# Altium project VCTB.PrjPcb
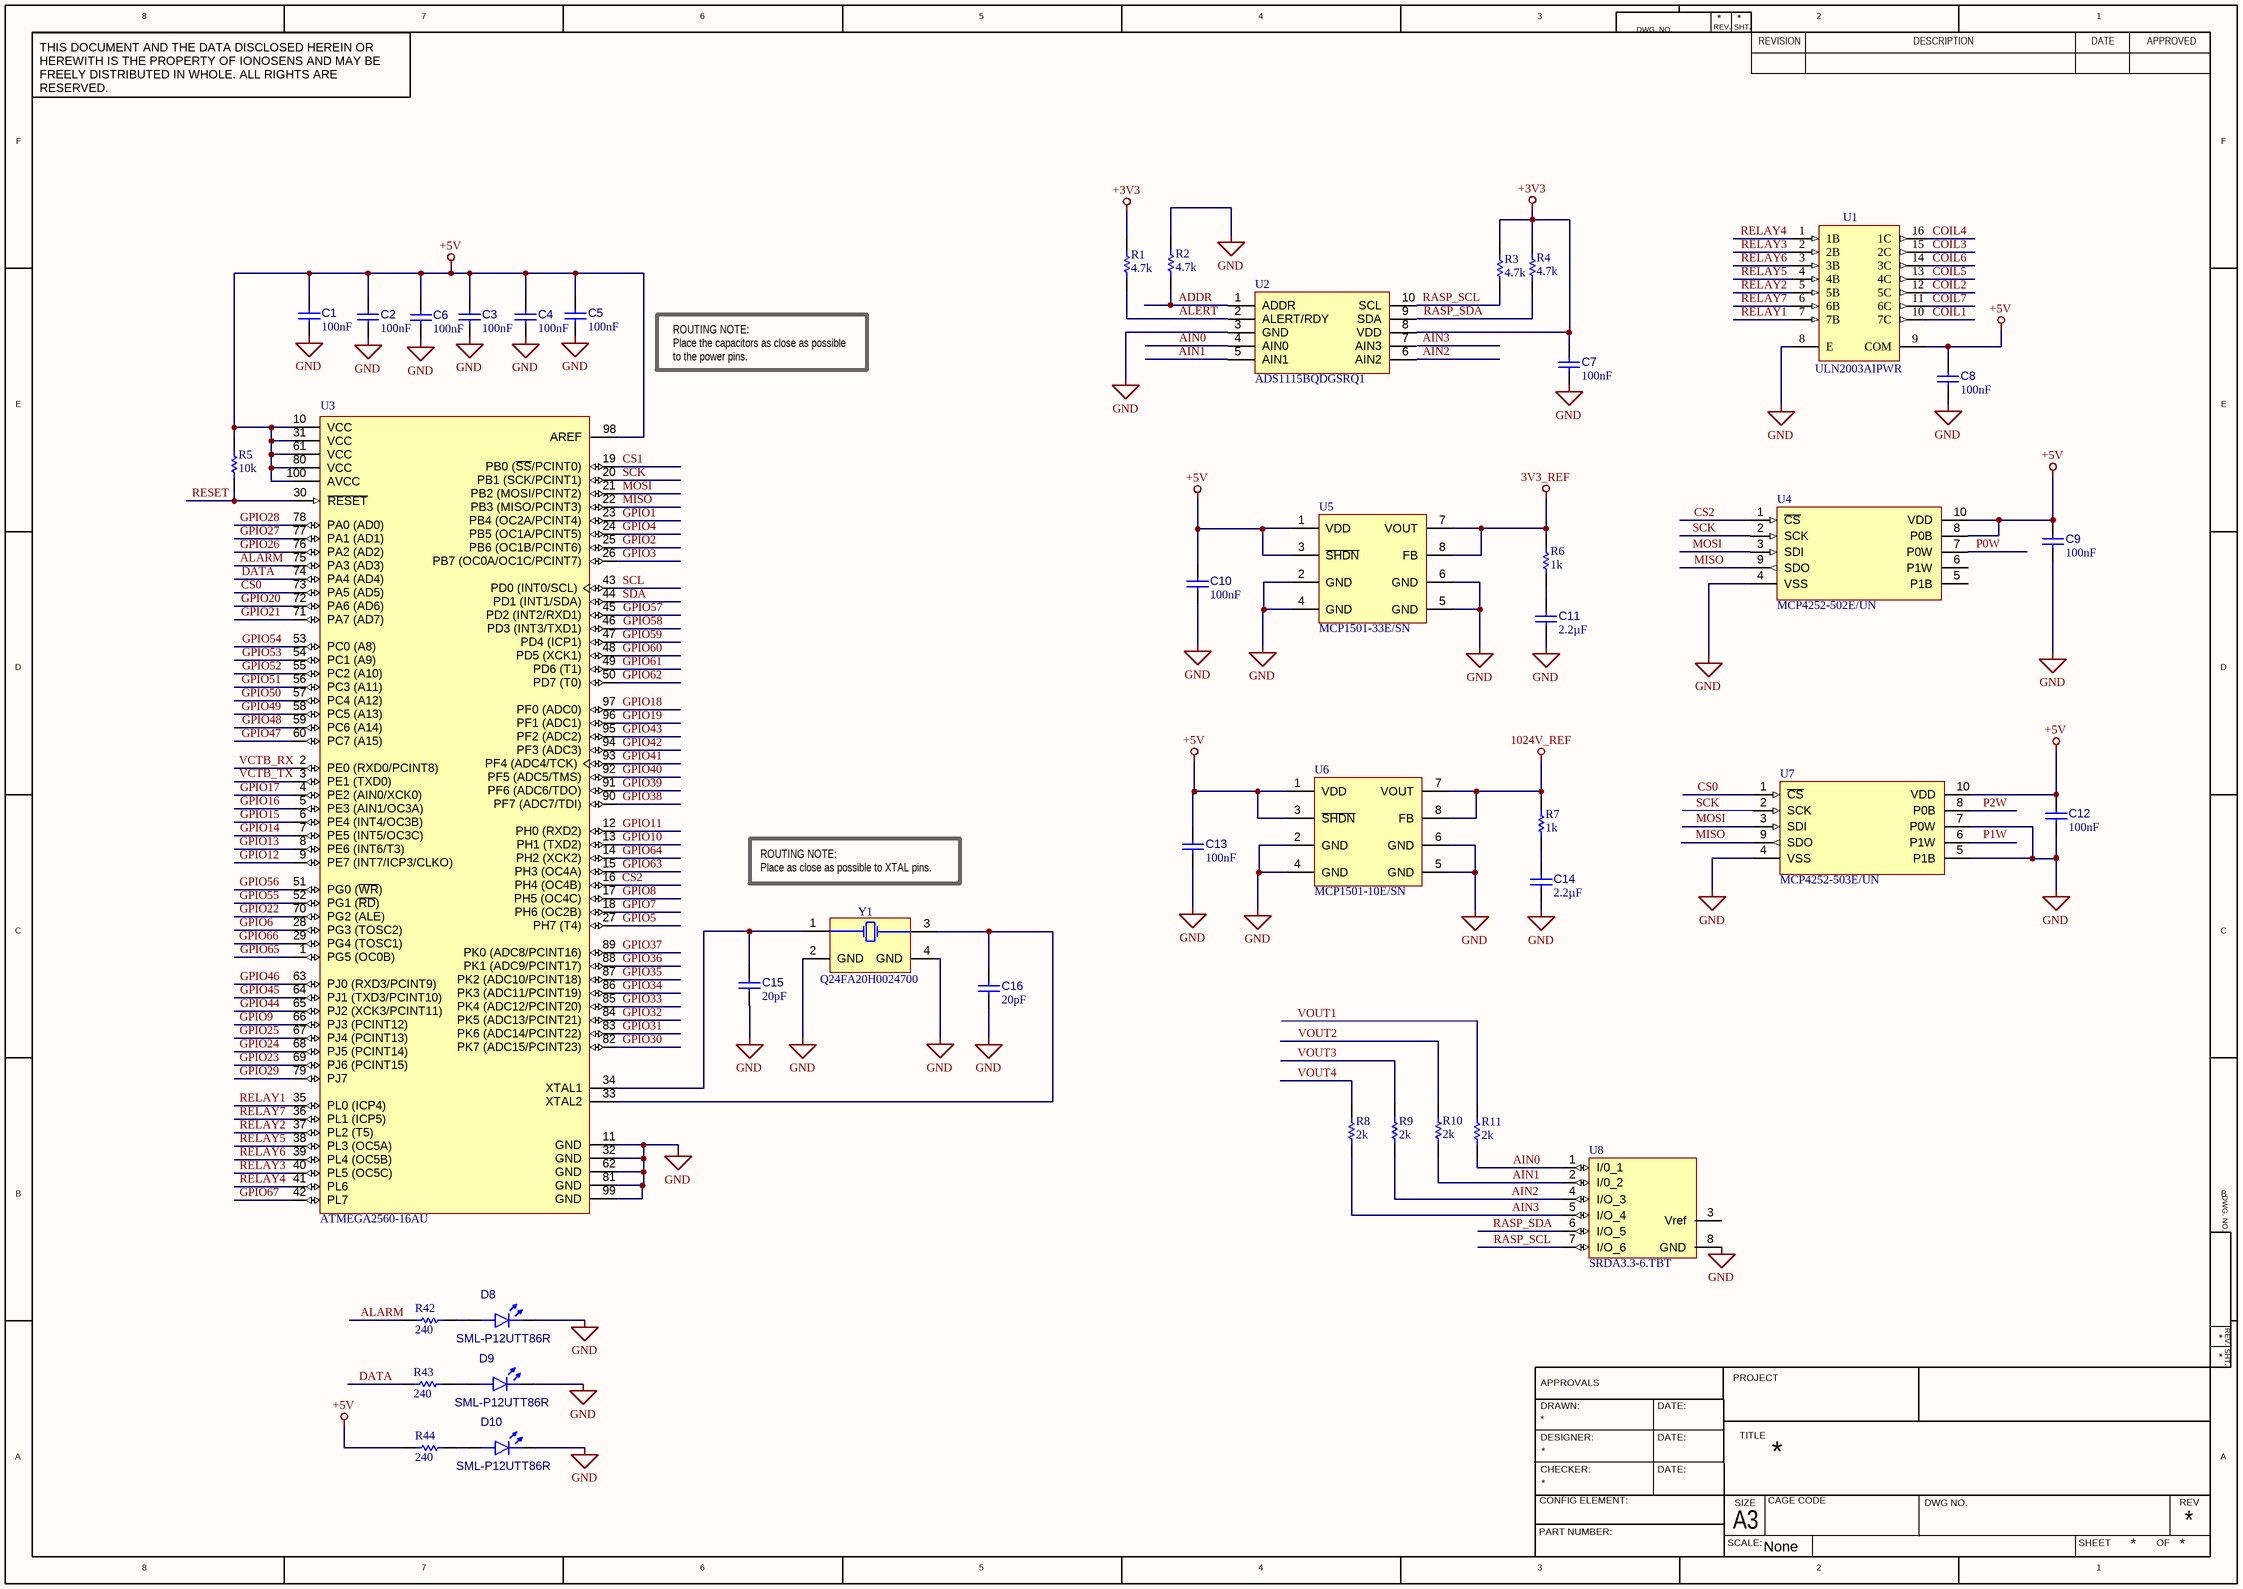
[diagram p0: Sheet1.SchDoc]
3 sheets, 104 parts. Net scope: global (net labels, ports and power ports of the same name join across sheets).
Board file: PCB1.PcbDoc
Sheets:
  Sheet1.SchDoc
  Sheet2.SchDoc
  Sheet3.SchDoc

## Sheet Sheet1.SchDoc
size 420 x 297 mm; Scale: None

### Parts
C1  value 100nF  [CAPC1005X06M]  (hidden comment: CC0402JRX7R7BB104)
C2  value 100nF  [CAPC1005X06M]  (hidden comment: CC0402JRX7R7BB104)
C3  value 100nF  [CAPC1005X06M]  (hidden comment: CC0402JRX7R7BB104)
C4  value 100nF  [CAPC1005X06M]  (hidden comment: CC0402JRX7R7BB104)
C5  value 100nF  [CAPC1005X06M]  (hidden comment: CC0402JRX7R7BB104)
C6  value 100nF  [CAPC1005X06M]  (hidden comment: CC0402JRX7R7BB104)
C7  value 100nF  [CAPC1005X06M]  (hidden comment: CC0402JRX7R7BB104)
C8  value 100nF  [CAPC1005X06M]  (hidden comment: CC0402JRX7R7BB104)
C9  value 100nF  [CAPC1005X06M]  (hidden comment: CC0402JRX7R7BB104)
C10  value 100nF  [CAPC1005X06M]  (hidden comment: CC0402JRX7R7BB104)
C11  value 2.2µF  [CAPC2012X14M]  (hidden comment: AC0805KKX7R8BB225)
C12  value 100nF  [CAPC1005X06M]  (hidden comment: CC0402JRX7R7BB104)
C13  value 100nF  [CAPC1005X06M]  (hidden comment: CC0402JRX7R7BB104)
C14  value 2.2µF  [CAPC2012X14M]  (hidden comment: AC0805KKX7R8BB225)
C15  value 20pF  [CAPC1005X06M]  (hidden comment: CC0402JRNPO9BN200)
C16  value 20pF  [CAPC1005X06M]  (hidden comment: CC0402JRNPO9BN200)
D8  SML-P12UTT86R  [DIOC1005X02R]
D9  SML-P12UTT86R  [DIOC1005X02R]
D10  SML-P12UTT86R  [DIOC1005X02R]
R1  value 4.7k  [RESC1005X04M]  (hidden comment: AC0402FR-074K7L)
R2  value 4.7k  [RESC1005X04M]  (hidden comment: AC0402FR-074K7L)
R3  value 4.7k  [RESC1005X04M]  (hidden comment: AC0402FR-074K7L)
R4  value 4.7k  [RESC1005X04M]  (hidden comment: AC0402FR-074K7L)
R5  value 10k  [RESC1005X04M]  (hidden comment: AC0402FR-0710KL)
R6  value 1k  [RESC1005X04M]  (hidden comment: AC0402FR-071KL)
R7  value 1k  [RESC1005X04M]  (hidden comment: AC0402FR-071KL)
R8  value 2k  [RESC1005X04M]  (hidden comment: AC0402FR-072KL)
R9  value 2k  [RESC1005X04M]  (hidden comment: AC0402FR-072KL)
R10  value 2k  [RESC1005X04M]  (hidden comment: AC0402FR-072KL)
R11  value 2k  [RESC1005X04M]  (hidden comment: AC0402FR-072KL)
R42  value 240  [RESC1005X04M]  (hidden comment: AC0402FR-07240RL)
R43  value 240  [RESC1005X04M]  (hidden comment: AC0402FR-07240RL)
R44  value 240  [RESC1005X04M]  (hidden comment: AC0402FR-07240RL)
U1  ULN2003AIPWR  [TSOP65P640X120-16M]
U2  ADS1115BQDGSRQ1  [TSSOP50P490X110-10M]
U3  ATMEGA2560-16AU  [ATML-100A_M]
U4  MCP4252-502E/UN  [TSSOP50P490X110-10N]
U5  MCP1501-33E/SN  [SOIC127P600X175-8M]
U6  MCP1501-10E/SN  [SOIC127P600X175-8M]
U7  MCP4252-503E/UN  [TSSOP50P490X110-10N]
U8  SRDA3.3-6.TBT  [SOIC127P600X175-8M]
Y1  Q24FA20H0024700  [FA-20H]

### Nets
3V3_REF: R6.2 U5.7(VOUT) U5.8(FB)
1024V_REF: R7.2 U6.7(VOUT) U6.8(FB)
+3V3: C7.2 R1.2 R3.2 R4.2 U2.8(VDD)
+5V: C1.2 C2.2 C3.2 C4.2 C5.2 C6.2 C8.2 C9.2 C10.2 C12.2 C13.2 R5.2 R44.1 U1.9(COM) U3.10(VCC) U3.31(VCC) U3.61(VCC) U3.80(VCC) U3.98(AREF) U3.100(AVCC) U4.8(P0B) U4.10(VDD) U5.1(VDD) U5.3(~{SHDN}) U6.1(VDD) U6.3(~{SHDN}) U7.10(VDD)
GND: C1.1 C2.1 C3.1 C4.1 C5.1 C6.1 C7.1 C8.1 C9.1 C10.1 C11.1 C12.1 C13.1 C14.1 C15.1 C16.1 D8.1(K) D9.1(K) D10.1(K) R2.2 U1.8(E) U2.3(GND) U3.11(GND) U3.32(GND) U3.62(GND) U3.81(GND) U3.99(GND) U4.4(VSS) U5.2(GND) U5.4(GND) U5.5(GND) U5.6(GND) U6.2(GND) U6.4(GND) U6.5(GND) U6.6(GND) U7.4(VSS) U7.5(P1B) U7.7(P0W) U8.8(GND) Y1.2(GND) Y1.4(GND)
ADDR: R2.1 U2.1(ADDR)
AIN0: R11.2 U2.4(AIN0) U8.1(I/0_1)
AIN1: R10.1 U2.5(AIN1) U8.2(I/0_2)
AIN2: R9.1 U2.6(AIN2) U8.4(I/O_3)
AIN3: R8.1 U2.7(AIN3) U8.5(I/O_4)
ALARM: R42.1 U3.75(PA3_(AD3))
ALERT: R1.1 U2.2(ALERT/RDY)
COIL1: U1.10(7C)
COIL2: U1.12(5C)
COIL3: U1.15(2C)
COIL4: U1.16(1C)
COIL5: U1.13(4C)
COIL6: U1.14(3C)
COIL7: U1.11(6C)
CS0: U3.73(PA5_(AD5)) U7.1(~{CS})
CS1: U3.19(PB0_(~{SS}/PCINT0))
CS2: U3.16(PH4_(OC4B)) U4.1(~{CS})
DATA: R43.1 U3.74(PA4_(AD4))
GPIO1: U3.23(PB4_(OC2A/PCINT4))
GPIO2: U3.25(PB6_(OC1B/PCINT6))
GPIO3: U3.26(PB7_(OC0A/OC1C/PCINT7))
GPIO4: U3.24(PB5_(OC1A/PCINT5))
GPIO5: U3.27(PH7_(T4))
GPIO6: U3.28(PG3_(TOSC2))
GPIO7: U3.18(PH6_(OC2B))
GPIO8: U3.17(PH5_(OC4C))
GPIO9: U3.66(PJ3_(PCINT12))
GPIO10: U3.13(PH1_(TXD2))
GPIO11: U3.12(PH0_(RXD2))
GPIO12: U3.9(PE7_(INT7/ICP3/CLKO))
GPIO13: U3.8(PE6_(INT6/T3))
GPIO14: U3.7(PE5_(INT5/OC3C))
GPIO15: U3.6(PE4_(INT4/OC3B))
GPIO16: U3.5(PE3_(AIN1/OC3A))
GPIO17: U3.4(PE2_(AIN0/XCK0))
GPIO18: U3.97(PF0_(ADC0))
GPIO19: U3.96(PF1_(ADC1))
GPIO20: U3.72(PA6_(AD6))
GPIO21: U3.71(PA7_(AD7))
GPIO22: U3.70(PG2_(ALE))
GPIO23: U3.69(PJ6_(PCINT15))
GPIO24: U3.68(PJ5_(PCINT14))
GPIO25: U3.67(PJ4_(PCINT13))
GPIO26: U3.76(PA2_(AD2))
GPIO27: U3.77(PA1_(AD1))
GPIO28: U3.78(PA0_(AD0))
GPIO29: U3.79(PJ7)
GPIO30: U3.82(PK7_(ADC15/PCINT23))
GPIO31: U3.83(PK6_(ADC14/PCINT22))
GPIO32: U3.84(PK5_(ADC13/PCINT21))
GPIO33: U3.85(PK4_(ADC12/PCINT20))
GPIO34: U3.86(PK3_(ADC11/PCINT19))
GPIO35: U3.87(PK2_(ADC10/PCINT18))
GPIO36: U3.88(PK1_(ADC9/PCINT17))
GPIO37: U3.89(PK0_(ADC8/PCINT16))
GPIO38: U3.90(PF7_(ADC7/TDI))
GPIO39: U3.91(PF6_(ADC6/TDO))
GPIO40: U3.92(PF5_(ADC5/TMS))
GPIO41: U3.93(PF4_(ADC4/TCK))
GPIO42: U3.94(PF3_(ADC3))
GPIO43: U3.95(PF2_(ADC2))
GPIO44: U3.65(PJ2_(XCK3/PCINT11))
GPIO45: U3.64(PJ1_(TXD3/PCINT10))
GPIO46: U3.63(PJ0_(RXD3/PCINT9))
GPIO47: U3.60(PC7_(A15))
GPIO48: U3.59(PC6_(A14))
GPIO49: U3.58(PC5_(A13))
GPIO50: U3.57(PC4_(A12))
GPIO51: U3.56(PC3_(A11))
GPIO52: U3.55(PC2_(A10))
GPIO53: U3.54(PC1_(A9))
GPIO54: U3.53(PC0_(A8))
GPIO55: U3.52(PG1_(~{RD}))
GPIO56: U3.51(PG0_(~{WR}))
GPIO57: U3.45(PD2_(INT2/RXD1))
GPIO58: U3.46(PD3_(INT3/TXD1))
GPIO59: U3.47(PD4_(ICP1))
GPIO60: U3.48(PD5_(XCK1))
GPIO61: U3.49(PD6_(T1))
GPIO62: U3.50(PD7_(T0))
GPIO63: U3.15(PH3_(OC4A))
GPIO64: U3.14(PH2_(XCK2))
GPIO65: U3.1(PG5_(OC0B))
GPIO66: U3.29(PG4_(TOSC1))
GPIO67: U3.42(PL7)
MISO: U3.22(PB3_(MISO/PCINT3)) U4.9(SDO) U7.9(SDO)
MOSI: U3.21(PB2_(MOSI/PCINT2)) U4.3(SDI) U7.3(SDI)
P0W: U4.7(P0W)
P1W: U7.6(P1W)
P2W: U7.8(P0B)
RASP_SCL: R3.1 U2.10(SCL) U8.7(I/O_6)
RASP_SDA: R4.1 U2.9(SDA) U8.6(I/O_5)
RELAY1: U1.7(7B) U3.35(PL0_(ICP4))
RELAY2: U1.5(5B) U3.37(PL2_(T5))
RELAY3: U1.2(2B) U3.40(PL5_(OC5C))
RELAY4: U1.1(1B) U3.41(PL6)
RELAY5: U1.4(4B) U3.38(PL3_(OC5A))
RELAY6: U1.3(3B) U3.39(PL4_(OC5B))
RELAY7: U1.6(6B) U3.36(PL1_(ICP5))
RESET: R5.1 U3.30(~{RESET})
SCK: U3.20(PB1_(SCK/PCINT1)) U4.2(SCK) U7.2(SCK)
SCL: U3.43(PD0_(INT0/SCL))
SDA: U3.44(PD1_(INT1/SDA))
VCTB_RX: U3.2(PE0_(RXD0/PCINT8))
VCTB_TX: U3.3(PE1_(TXD0))
VOUT1: R11.1
VOUT2: R10.2
VOUT3: R9.2
VOUT4: R8.2
NetC11_2: C11.2 R6.1
NetC14_2: C14.2 R7.1
NetC15_2: C15.2 U3.34(XTAL1) Y1.1(X1)
NetC16_2: C16.2 U3.33(XTAL2) Y1.3(X2)
NetD8_2: D8.2(A) R42.2
NetD9_2: D9.2(A) R43.2
NetD10_2: D10.2(A) R44.2

Not connected (* = marked no-connect by the designer): U4 5(P1B) 6(P1W); U8 3(Vref)

### Notes on the sheet
- ROUTING NOTE:
  Place the capacitors as close as possible to the power pins.
- (near Y1) ROUTING NOTE:
  Place as close as possible to XTAL pins.
- 8
- 7
- 6
- 5
- 4
- 3
- DWG. NO.
- REV.
- SHT.
- REVISION
- 2
- DESCRIPTION
- DATE
- 1
- APPROVED
- THIS DOCUMENT AND THE DATA DISCLOSED HEREIN OR HEREWITH IS THE PROPERTY OF IONOSENS AND MAY BE FREELY DISTRIBUTED IN WHOLE. ALL RIGHTS ARE RESERVED.
- F
- E
- D
- C
- B
- DRAWN:
- APPROVALS
- DATE:
- PROJECT
- A
- CHECKER:
- DESIGNER:
- TITLE
- PART NUMBER:
- CONFIG ELEMENT:
- SCALE:
- A3
- SIZE
- CAGE CODE
- DWG NO.
- SHEET
- OF
- REV

### Library data of the parts
C1-C10 C12 C13 = C01-0402-01-00001-1: Cap Ceramic 100nF 50V X7R 5% SMD 0402 125°C; Manufacturer: YAGEO; Voltage Rating: 16V; Case/Package: 0402; Capacitor Type: Ceramic; Min Operating Temperature: -55°C; Width: 508µm; Length: 1mm; Tolerance: 5%; Dielectric: X7R; RoHS Compliant: Yes; Pins: 2; Composition: Ceramic; Depth: 500µm; Voltage Rating (DC): 16V; Mount: Surface Mount; Mounting Technology: Surface Mount; Termination: SMD/SMT; Manufacturer P/N: CC0402JRX7R7BB104; Thickness: 558.8µm; Max Operating Temperature: 125°C
C11 C14 = C01-0402-01-00007-1: Cap Ceramic 2.2uF 25V X7R +-10% SMD 0805 125°C; Manufacturer: YAGEO; Tolerance: 10%; Dielectric: XR7; Max Operating Temperature: 125°C; Composition: Ceramic; Min Operating Temperature: -55°C; Thickness: 711.2µm; Depth: 1.25mm; RoHS Compliant: Yes; Width: 1.2466mm; Mounting Technology: Surface Mount; Case/Package: 0805; Termination: SMD/SMT; Voltage Rating: 25V; Pins: 2; Mount: Surface Mount; Manufacturer P/N: AC0805KKX7R8BB225; Capacitor Type: Ceramic; Length: 2mm; Voltage Rating (DC): 25V
C15 C16 = C01-0402-01-00008-1: Cap Ceramic 20pF 50V C0G 5% SMD 0402 125°C; Manufacturer: YAGEO; Dielectric: COG; Case/Package: 0402; Tolerance: 5%; Thickness: 558.8µm; Termination: SMD/SMT; Manufacturer P/N: CC0402JRNPO9BN200; Voltage Rating: 50V; Length: 990.6µm; Depth: 500µm; Width: 508µm; Min Operating Temperature: -55°C; Mount: Surface Mount; Voltage Rating (DC): 50V; Pins: 2; Capacitor Type: Ceramic; RoHS Compliant: Yes; Composition: Ceramic; Mounting Technology: Surface Mount; Max Operating Temperature: 125°C
D8-D10 = D01-0402-01-00001-1: Led red 0402; Manufacturer: ROHM; Number of LEDs: 1; Max Power Dissipation: 52mW; Luminous Intensity: 85 mcd; Dominant Wavelength: 620 nm; Lens Style: Rectangular, Square; Forward Current: 20 mA; Forward Voltage: 2V; Mounting Technology: SMD; Case/Package: 0402; Min Operating Temperature: -40°C; Max Operating Temperature: 85°C; Manufacturer P/N: SML-P12UTT86R; Colour: red; RoHS Compliant: Yes; Pins: 2
R1-R4 = R01-0402-01-00105-2: RES SMD 4.7K OHM 1% 1/16W 0402; Manufacturer: Yageo; Temperature Coefficient: 100 ppm/ºC; Power Rating: 62.5mW; Voltage Rating: 50V; Width: 508µm; Max Operating Temperature: 155°C; Manufacturer P/N: AC0402FR-074K7L; Features: Automotive AEC-Q200, Moisture Resistant; Number of Terminations: 2; Height: 370µm; Min Operating Temperature: -55°C; Case/Package: 0402; Tolerance: 1%; RoHS: Yes; Packaging: Tape & Reel; Composition: Thick Film; Length: 990.6µm
R5 = R01-0402-01-00169-2: RES SMD 10K OHM 1% 1/16W 0402; Manufacturer: Yageo; Temperature Coefficient: 100 ppm/ºC; Power Rating: 62.5mW; Voltage Rating: 50V; Length: 990.6µm; Height: 370µm; Min Operating Temperature: -55°C; Case/Package: 0402; Features: Automotive AEC-Q200, Moisture Resistant; Packaging: Tape & Reel; Width: 508µm; Manufacturer P/N: AC0402FR-0710KL; RoHS: Yes; Max Operating Temperature: 155°C; Tolerance: 1%; Composition: Thick Film; Number of Terminations: 2
R6 R7 = R01-0402-01-00029-2: RES SMD 1K OHM 1% 1/16W 0402; Manufacturer: Yageo; Power Rating: 62.5mW; Voltage Rating: 50V; Temperature Coefficient: 100 ppm/ºC; Length: 990.6µm; Case/Package: 0402; Features: Automotive AEC-Q200, Moisture Resistant; RoHS: Yes; Packaging: Tape & Reel; Min Operating Temperature: -55°C; Composition: Thick Film; Width: 508µm; Number of Terminations: 2; Tolerance: 1%; Height: 370µm; Manufacturer P/N: AC0402FR-071KL; Max Operating Temperature: 155°C
R8-R11 = R01-0402-01-00067-3: RES SMD 2K OHM 1% 1/16W 0402; Manufacturer: Yageo; Voltage Rating: 50V; Power Rating: 62.5mW; Temperature Coefficient: 100 ppm/ºC; Tolerance: 1%; Length: 990.6µm; Width: 508µm; Number of Terminations: 2; Packaging: Tape & Reel; Composition: Thick Film; RoHS: Yes; Height: 370µm; Case/Package: 0402; Manufacturer P/N: AC0402FR-072KL; Features: Automotive AEC-Q200, Moisture Resistant; Min Operating Temperature: -55°C; Max Operating Temperature: 155°C
R42-R44 = R01-0402-01-00437-2: RES SMD 240 OHM 1% 1/16W 0402; Manufacturer: Yageo; Temperature Coefficient: 100 ppm/ºC; Power Rating: 62.5mW; Voltage Rating: 50V; Packaging: Tape & Reel; Manufacturer P/N: AC0402FR-07240RL; Height: 370µm; Case/Package: 0402; Composition: Thick Film; Max Operating Temperature: 155°C; Number of Terminations: 2; RoHS: Yes; Min Operating Temperature: -55°C; Tolerance: 1%; Width: 508µm; Length: 990.6µm; Features: Automotive AEC-Q200, Moisture Resistant
U1 = CMP-0005-0001-00001-1: 50-V, 7-ch darlington transistor array, -40 to 105C 16-TSSOP -40 to 105; Manufacturer: Texas Instruments; Voltage Rating: 50V; Min Operating Temperature: 105°C; RoHS Compliant: yes; Pins: 16; Case/Package: TSSOP; Mounting Technology: SMD; Length: 5mm; Manufacturer P/N: ULN2003AIPWR; Height: 1.2mm; Max Operating Temperature: -40°C; Width: 4.4mm
U2 = CMP-0015-00000-5: 4-Channel Single ADC Delta-Sigma 860sps 16-bit Serial Automotive 10-Pin VSSOP; Manufacturer: Texas Instrument; Channels: 4; Interface: I2C; Min Operating Temperature: -40°C; Mounting Technology: SMD; RoHS Compliant: yes; Pins: 10; Manufacturer P/N: ADS1115BQDGSRQ1; Max Operating Temperature: 125°C; Case/Package: VSSOP10
U3 = U01-0007-01-00000-1: AVR ATmega Microcontroller 8-bit 16MHz 256KB FLASH TQFP100; Manufacturer: Microchip; Oscillator Type: External; Interface: I2C, SPI, UART; Minimum Supply Voltage: 4.5V; Peripherals: Brown-out Detect/Reset, POR, PWM, WDT; Number of A/D: 1 AD / 16 channels; Watchdog Timer: Yes; Number of I/O: 86; RAM Size: 8KB; Max Supply Voltage: 5.5V; Max Operating Temperature: 85°C; Manufacturer P/N: ATMEGA2560-16AU; Memory Size: 256KB; Mounting Technology: SMD; Memory Type: FLASH; Pins: 100; Height: 1.2mm; Case/Package: A; RoHS: Yes; Min Operating Temperature: -40°C; Max Frequency: 16MHz; Number of Programmable I/O: 86; Contact Plating: Tin; Core Architecture: AVR; Frequency: 16MHz; Width: 16.25mm
U4 = CMP-0005-0002-00000-2: Digital Potentiometer 5kOhm 256POS Volatile Linear Automotive 10-Pin MSOP; Manufacturer: Microchip; Temperature Coefficient: 150 ppm/°C; Number of Positions: 256; Tolerance: 20%; Number of Elements: 2; Min Supply Voltage: 1.8V; Max Supply Voltage: 5.5V; Resistance: 5k; Interface: SPI; Length: 3mm; Min Operating Temperature: -40°C; Pins: 10; Manufacturer P/N: MCP4252-502E/UN; RoHS Compliant: yes; Memory Type: Volatile; Case/Package: MSOP; Mount: SMD; Mounting Technology: SMD; Max Operating Temperature: 125°C; Height: 950µm; Width: 3mm
U5 = CMP-019-00050-1: V-Ref Precision 3.3V 20mA 8-Pin SOIC; Manufacturer: Microchip; Temperature Coefficient: 50 ppm/°C; Min Supply Voltage: 1.65V; Max Supply Voltage: 5.5V; Tolerance: 0.1 %; Output Voltage: 3.3V; Min Operating Temperature: -40°C; Max Operating Temperature: 125°C; Case/Package: SOIC; Pins: 8; Output Current: 20 mA; RoHS Compliant: yes; Mounting Technology: SMD; Manufacturer P/N: MCP1501-33E/SN
U6 = CMP-019-00049-1: V-Ref Precision 1.024V 20mA 8-Pin SOIC; Manufacturer: Microchip; Min Supply Voltage: 1.65V; Output Voltage: 1.024kV; Tolerance: 0.1 %; Max Supply Voltage: 5.5V; Temperature Coefficient: 50 ppm/°C; Min Operating Temperature: -40°C; Case/Package: SOIC; Pins: 8; Max Operating Temperature: 125°C; Manufacturer P/N: MCP1501-10E/SN; RoHS Compliant: yes; Mounting Technology: SMD; Output Current: 20 mA
U7 = CMP-0005-0002-00001-2: Digital Potentiometer 50kOhm 256POS Volatile Linear Automotive 10-Pin MSOP; Manufacturer: Microchip; Temperature Coefficient: 150 ppm/°C; Tolerance: 20%; Number of Positions: 256; Min Supply Voltage: 1.8V; Interface: SPI; Max Supply Voltage: 5.5V; Resistance: 50k; Number of Elements: 2; Length: 3mm; Max Operating Temperature: 125°C; Case/Package: MSOP; Manufacturer P/N: MCP4252-503E/UN; RoHS Compliant: yes; Mounting Technology: SMD; Memory Type: Volatile; Min Operating Temperature: -40°C; Width: 3mm; Pins: 10; Mount: SMD; Height: 950µm
U8 = CMP-0005-0001-00000-1: SRDA Series 15 V 8 pF SMT RailClamp® Low Capacitance TVS Diode Array - SOIC-8; Manufacturer: Semtech; Number of Channels: 6; Peak Pulse Current: 25A; Max Breakdown Voltage: 6V; Max Power Dissipation: 500W; Direction: Unidirectional; Clamping Voltage: 15V; Capacitance: 8pF; Breakdown Voltage: 3.2V; Leakage Current: 1µV; Manufacturer P/N: SRDA3.3-6.TBT; Height: 1.75mm; Case/Package: so-8; Pins: 8; Length: 5mm; Min Operating Temperature: -55°C; Mounting Technology: SMD; Max Operating Temperature: 125°C; RoHS Compliant: yes; Width: 4mm
Y1 = Y01-0001-01-00000-11: 16MHz ±10ppm 16pF 80Ω SMD-2520_4P; Manufacturer: SEIKO-EPSON; ESR: 80; RoHS Compliant: yes; Min Operating Temperature: -40°C; Load Capacitance: 16pF; Mounting Technology: SMD; Pins: 4; Case/Package: SMD-2520_4P; Max Operating Temperature: 85°C; Frequency: 16MHz; Manufacturer P/N: Q24FA20H0024700

## Sheet Sheet2.SchDoc
size 420 x 297 mm
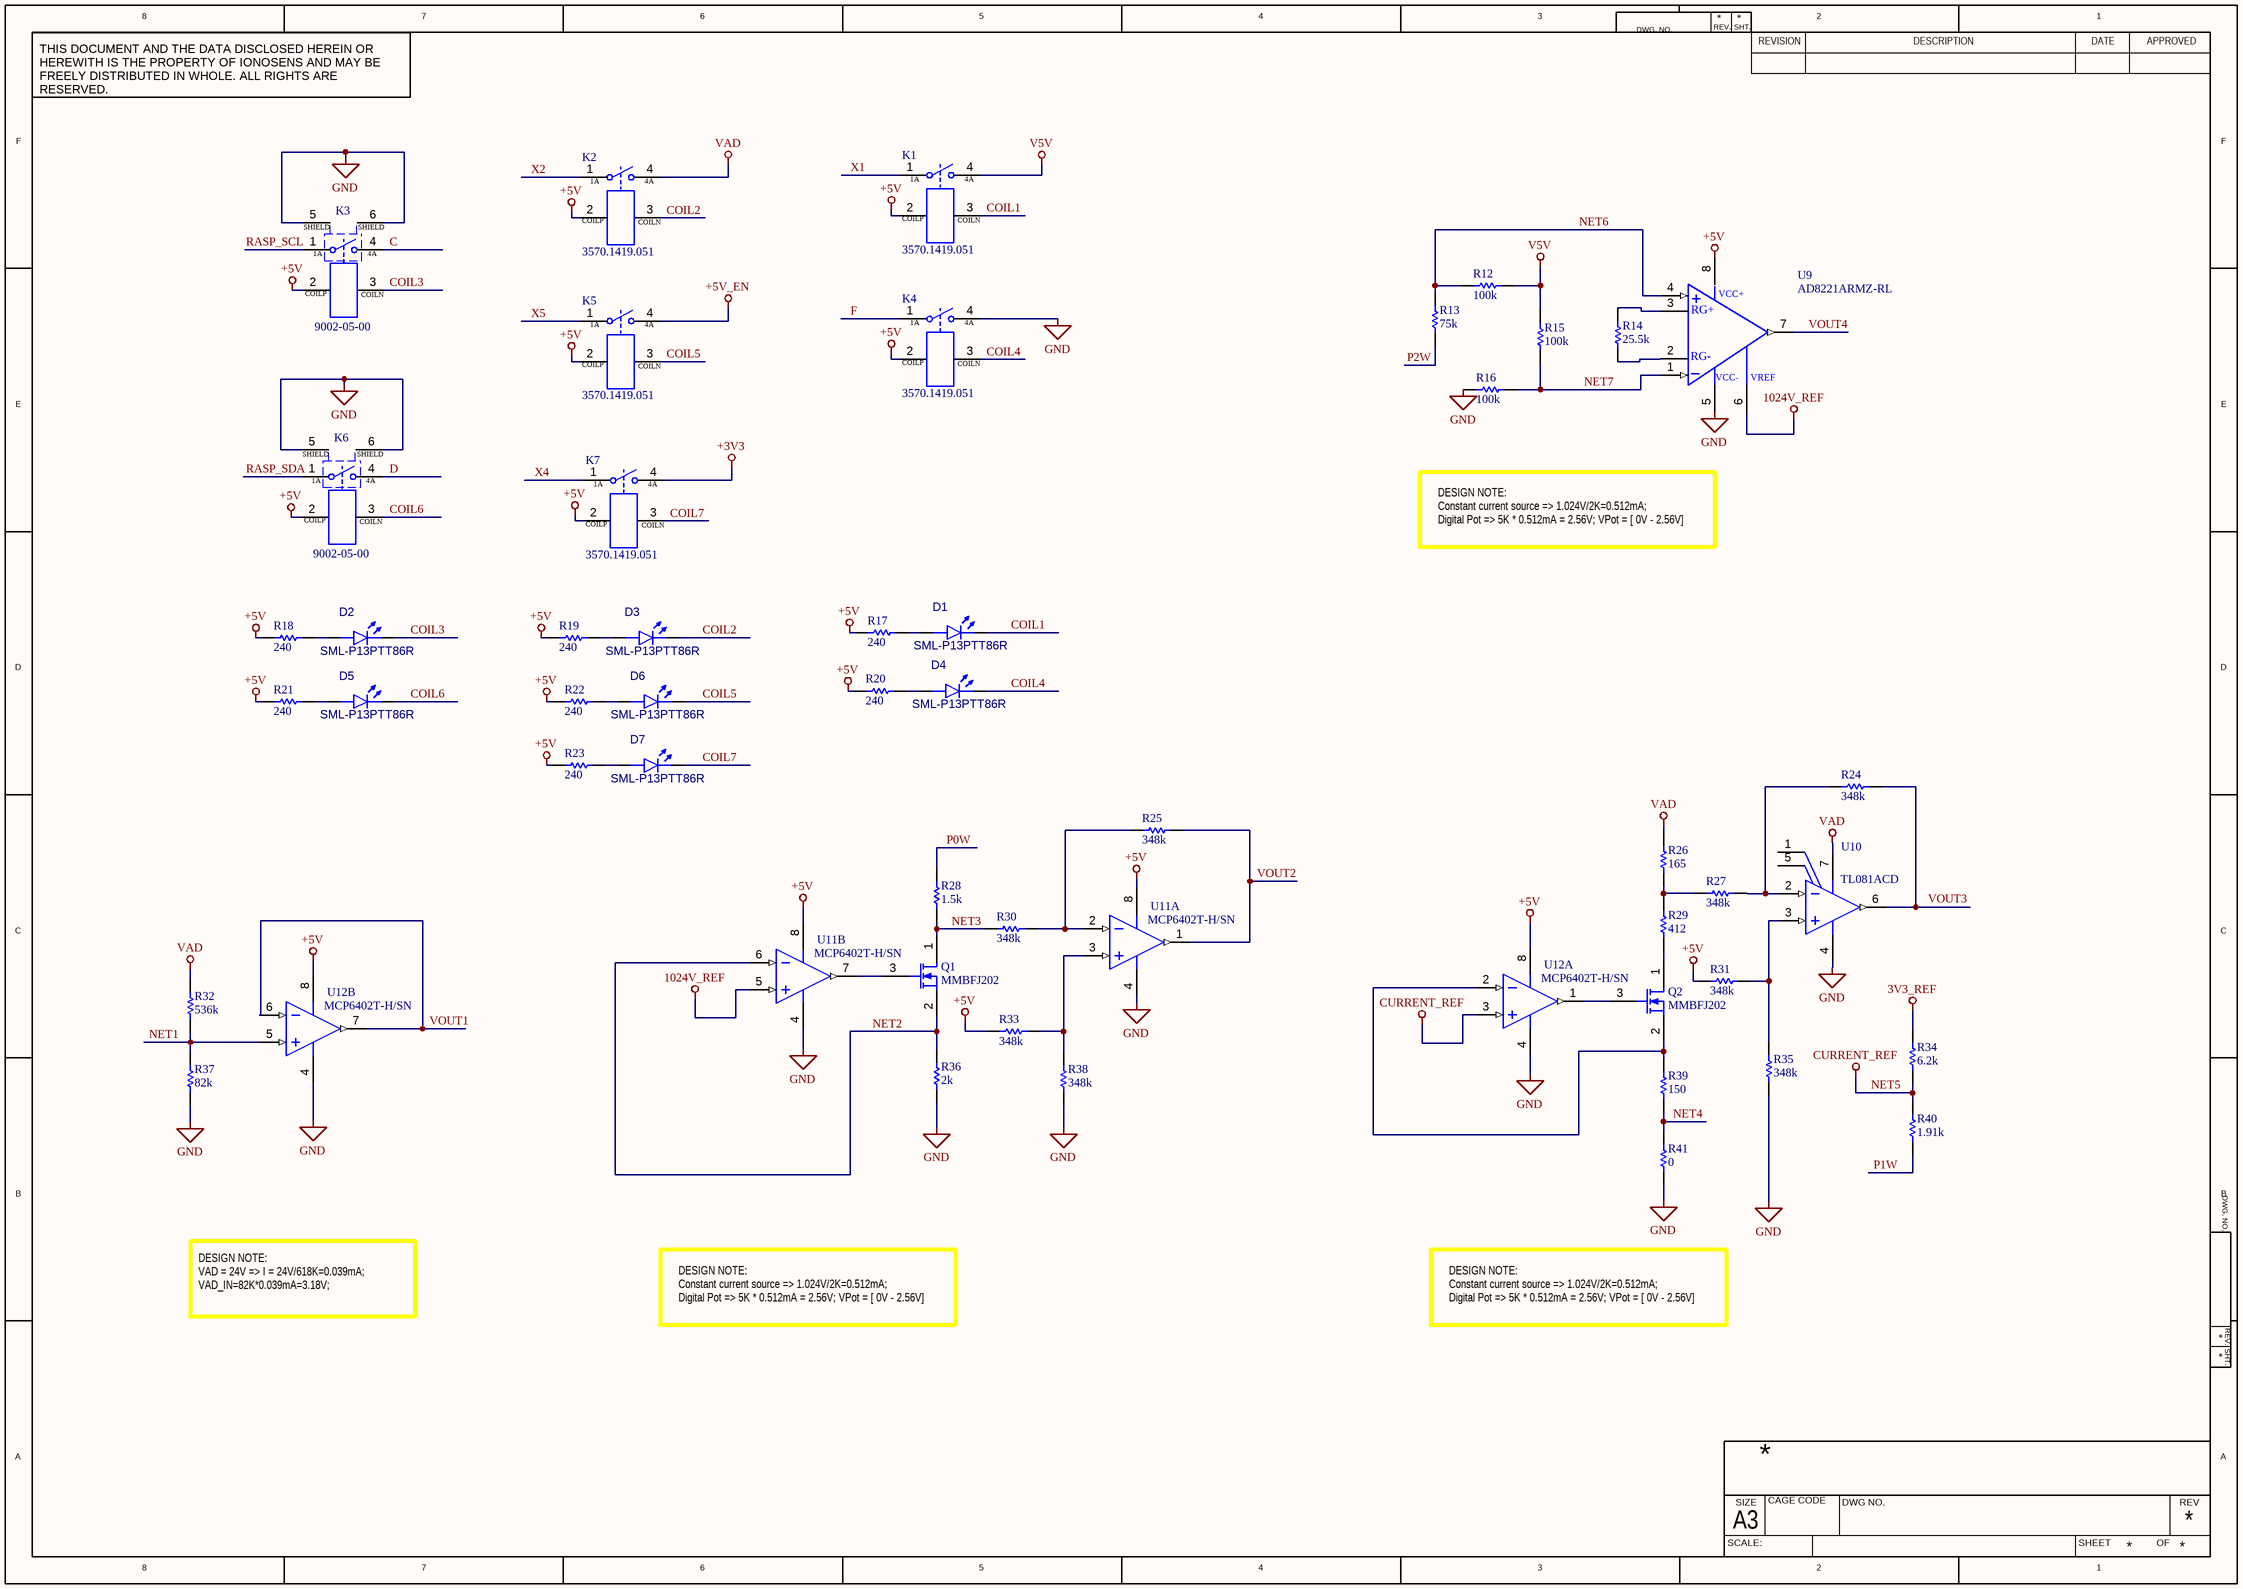
[diagram p1: Sheet2.SchDoc]

### Parts
D1  SML-P13PTT86R  [DIOC1005X02R]
D2  SML-P13PTT86R  [DIOC1005X02R]
D3  SML-P13PTT86R  [DIOC1005X02R]
D4  SML-P13PTT86R  [DIOC1005X02R]
D5  SML-P13PTT86R  [DIOC1005X02R]
D6  SML-P13PTT86R  [DIOC1005X02R]
D7  SML-P13PTT86R  [DIOC1005X02R]
K1  3570.1419.051  [3570.1419]
K2  3570.1419.051  [3570.1419]
K3  9002-05-00  [SIP564W40P254L1980H810Q6 - Cloned]
K4  3570.1419.051  [3570.1419]
K5  3570.1419.051  [3570.1419]
K6  9002-05-00  [SIP564W40P254L1980H810Q6 - Cloned]
K7  3570.1419.051  [3570.1419]
Q1  MMBFJ202  [SOT95P237X111-3M]
Q2  MMBFJ202  [SOT95P237X111-3M]
R12  value 100k  [RESC1005X04M]  (hidden comment: AC0402FR-07100KL)
R13  value 75k  [RESC1005X04M]  (hidden comment: AC0402FR-0775KL)
R14  value 25.5k  [RESC1005X04M]  (hidden comment: AC0402FR-0725K5L)
R15  value 100k  [RESC1005X04M]  (hidden comment: AC0402FR-07100KL)
R16  value 100k  [RESC1005X04M]  (hidden comment: AC0402FR-07100KL)
R17  value 240  [RESC1005X04M]  (hidden comment: AC0402FR-07240RL)
R18  value 240  [RESC1005X04M]  (hidden comment: AC0402FR-07240RL)
R19  value 240  [RESC1005X04M]  (hidden comment: AC0402FR-07240RL)
R20  value 240  [RESC1005X04M]  (hidden comment: AC0402FR-07240RL)
R21  value 240  [RESC1005X04M]  (hidden comment: AC0402FR-07240RL)
R22  value 240  [RESC1005X04M]  (hidden comment: AC0402FR-07240RL)
R23  value 240  [RESC1005X04M]  (hidden comment: AC0402FR-07240RL)
R24  value 348k  [RESC1005X04M]  (hidden comment: AC0402FR-07348KL)
R25  value 348k  [RESC1005X04M]  (hidden comment: AC0402FR-07348KL)
R26  value 165  [RESC1005X04M]  (hidden comment: AC0402FR-07165RL)
R27  value 348k  [RESC1005X04M]  (hidden comment: AC0402FR-07348KL)
R28  value 1.5k  [RESC1005X04M]  (hidden comment: AC0402FR-071K5L)
R29  value 412  [RESC1005X04M]  (hidden comment: AC0402FR-07412RL)
R30  value 348k  [RESC1005X04M]  (hidden comment: AC0402FR-07348KL)
R31  value 348k  [RESC1005X04M]  (hidden comment: AC0402FR-07348KL)
R32  value 536k  [RESC1005X04M]  (hidden comment: AC0402FR-07536KL)
R33  value 348k  [RESC1005X04M]  (hidden comment: AC0402FR-07348KL)
R34  value 6.2k  [RESC1005X04M]  (hidden comment: AC0402FR-076K2L)
R35  value 348k  [RESC1005X04M]  (hidden comment: AC0402FR-07348KL)
R36  value 2k  [RESC1005X04M]  (hidden comment: AC0402FR-072KL)
R37  value 82k  [RESC1005X04M]  (hidden comment: AC0402FR-0782KL)
R38  value 348k  [RESC1005X04M]  (hidden comment: AC0402FR-07348KL)
R39  value 150  [RESC1005X04M]  (hidden comment: AC0402FR-07150RL)
R40  value 1.91k  [RESC1005X04M]  (hidden comment: AC0402FR-071K91L)
R41  value 0  [RESC1608X06M]  (hidden comment: AC0603FR-070RL)
U9  AD8221ARMZ-RL  [TSOP65P490X110-8N]
U10  TL081ACD  [SOIC127P600X175-8M]
U11  MCP6402T-H/SN  [SOIC127P600X175-8M]  (parts A,B of 2)
U12  MCP6402T-H/SN  [SOIC127P600X175-8M]  (parts A,B of 2)

### Nets
3V3_REF: R34.2
1024V_REF: U9.6(VREF) U11.5(2IN+)
+3V3: K7.4(4A)
+5V: K1.2(COILP) K2.2(COILP) K3.2(COILP) K4.2(COILP) K5.2(COILP) K6.2(COILP) K7.2(COILP) R17.1 R18.1 R19.1 R20.1 R21.1 R22.1 R23.1 R31.1 R33.1 U9.8(VDD) U11.8(VCC) U12.8(VCC)
+5V_EN: K5.4(4A)
GND: K3.5(Shield) K3.6(Shield) K4.4(4A) K6.5(Shield) K6.6(Shield) R16.1 R35.1 R36.1 R37.1 R38.1 R41.1 U9.5(VSS) U10.4(VSS) U11.4(GND) U12.4(GND)
NET5: R34.1 R40.2 U12.3(1IN+)  [also labelled CURRENT_REF]
V5V: K1.4(4A) R12.2 R15.2
VAD: K2.4(4A) R26.2 R32.2 U10.7(VDD)
C: K3.4(4A)
COIL1: D1.1(K) K1.3(COILN)
COIL2: D3.1(K) K2.3(COILN)
COIL3: D2.1(K) K3.3(COILN)
COIL4: D4.1(K) K4.3(COILN)
COIL5: D6.1(K) K5.3(COILN)
COIL6: D5.1(K) K6.3(COILN)
COIL7: D7.1(K) K7.3(COILN)
D: K6.4(4A)
F: K4.1(1A)
NET1: R32.1 R37.2 U12.5(2IN+)
NET2: Q1.2(S) R36.2 U11.6(2IN-)
NET3: Q1.1(D) R28.1 R30.1
NET4: R39.1 R41.2
NET6: R12.1 R13.2 U9.4(VIN+)
NET7: R15.1 R16.2 U9.1(VIN-)
P0W: R28.2
P1W: R40.1
P2W: R13.1
RASP_SCL: K3.1(1A)
RASP_SDA: K6.1(1A)
VOUT1: U12.6(2IN-) U12.7(2OUT)
VOUT2: R25.2 U11.1(1OUT)
VOUT3: R24.2 U10.6(VOUT)
VOUT4: U9.7(VOUT)
X1: K1.1(1A)
X2: K2.1(1A)
X4: K7.1(1A)
X5: K5.1(1A)
NetD1_2: D1.2(A) R17.2
NetD2_2: D2.2(A) R18.2
NetD3_2: D3.2(A) R19.2
NetD4_2: D4.2(A) R20.2
NetD5_2: D5.2(A) R21.2
NetD6_2: D6.2(A) R22.2
NetD7_2: D7.2(A) R23.2
NetQ1_3: Q1.3(G) U11.7(2OUT)
NetQ2_1: Q2.1(D) R29.1
NetQ2_2: Q2.2(S) R39.2 U12.2(1IN-)
NetQ2_3: Q2.3(G) U12.1(1OUT)
NetR14_1: R14.1 U9.2(RG-)
NetR14_2: R14.2 U9.3(RG+)
NetR24_1: R24.1 R27.2 U10.2(VIN-)
NetR25_1: R25.1 R30.2 U11.2(1IN-)
NetR26_1: R26.1 R27.1 R29.2
NetR31_2: R31.2 R35.2 U10.3(VIN+)
NetR33_2: R33.2 R38.2 U11.3(1IN+)

Not connected (* = marked no-connect by the designer): U10 1(OFFSET_N1) 5(OFFSET_N2)

### Notes on the sheet
- DESIGN NOTE:
  Constant current source => 1.024V/2K=0.512mA;         Digital Pot => 5K * 0.512mA = 2.56V; VPot = [ 0V - 2.56V]
- DESIGN NOTE:
  VAD = 24V => I = 24V/618K=0.039mA; VAD_IN=82K*0.039mA=3.18V;
- 8
- 7
- 6
- 5
- 4
- 3
- DWG. NO.
- REV.
- SHT.
- REVISION
- 2
- DESCRIPTION
- DATE
- 1
- APPROVED
- THIS DOCUMENT AND THE DATA DISCLOSED HEREIN OR HEREWITH IS THE PROPERTY OF IONOSENS AND MAY BE FREELY DISTRIBUTED IN WHOLE. ALL RIGHTS ARE RESERVED.
- F
- E
- D
- C
- B
- A
- SCALE:
- A3
- SIZE
- CAGE CODE
- DWG NO.
- SHEET
- OF
- REV
- (in symbol CMP-014-00003-2) VCC+; VCC-
- (in symbol K01-0008-01-00002-6) SHIELD

### Library data of the parts
D1-D7 = D01-0402-01-00000-1: Led green 0402; Manufacturer: ROHM; Forward Voltage: 2.1V; Max Power Dissipation: 52mW; Forward Current: 20 mA; Number of LEDs: 1; Dominant Wavelength: 560 nm; Luminous Intensity: 10 mcd; Lens Style: Rectangular, Square; Min Operating Temperature: -40°C; Mounting Technology: SMD; Colour: Green; Manufacturer P/N: SML-P13PTT86R; Max Operating Temperature: 85°C; Pins: 2; RoHS Compliant: Yes; Case/Package: 0402
K1 K2 K4 K5 K7 = K01-0008-01-00008-1: Reed Relay, Mini SIP, 5 VDC; 1 Form A, 15W, 200 VDC, 1.25A; Manufacturer: Comus; Number of Terminal: 4; Contact Current Rating: 1A; Coil Current: 10mA; Switching Voltage: 200V; Rise time: 0s; Contact Resistence: 0.15; Coil resitence: 500; Operate Time: 350µs; Coil Voltage (DC): 5V; Insulation Resistance: 0; Release Time: 100µs; Manufacturer P/N: 3570.1419.051; Mounting Technology: TH; Contact Material: -; Relay Type: Reed; Width: 15.24mm; Contact Form: 1A; Packaging: SIP; Switching Current: 1A; Pins: 4; Case/Package: SIP; Coil Type: -; Min Operating Temperature: -40°C; RoHS: Yes; Height: 6.98mm; Max Operating Temperature: 85°C
K3 K6 = K01-0008-01-00002-6: Reed Relay 5VDC 350Ohm 0.5A SPST-NO THT; Manufacturer: COTO; Rise time: 350µs; Coil Current: 14.28mA; Release Time: 100µs; Number of Terminal: 6; Contact Form: SPST; Insulation Resistance: 1T; Coil Type: Non-Latching; Coil Voltage (DC): 5V; Contact Current Rating: 500mA; Contact Resistence: 0.2; Switching Voltage: 200V; Coil resitence: 350; Relay Type: RF; Mounting Technology: Through Hole; Case/Package: SIP; Contact Material: Ruthenium; Packaging: Bulk; Width: 19.3mm; Height: 7.6mm; Max Operating Temperature: 85°C; RoHS: Yes; Min Operating Temperature: -20°C; Pins: 6; Switching Current: 500mA; Operate Time: 350µs; Manufacturer P/N: 9002-05-00
Q1 Q2 = CMP-013-00036-1: MMBFJ202 Series 40 V 4.5 mA N-Channel General Purpose Amplifier - SOT-23; Manufacturer: Semi on; Power: 350mW; Vgs (Max): -40V; Transistor Type: Mosfet Channel N; Case/Package: SOT-23; Pins: 3; Mounting Technology: SMD; Manufacturer P/N: MMBFJ202; Max Operating Temperature: 150°C; Min Operating Temperature: -55°C; Vgs(th) (Max) @ Id: -; RoHS Compliant: yes
R12 R15 R16 = R01-0402-01-00360-2: RES SMD 100K OHM 1% 1/16W 0402; Manufacturer: Yageo; Voltage Rating: 50V; Power Rating: 62.5mW; Temperature Coefficient: 100 ppm/ºC; Manufacturer P/N: AC0402FR-07100KL; Packaging: Tape & Reel; Features: Automotive AEC-Q200, Moisture Resistant; Width: 508µm; RoHS: Yes; Height: 370µm; Number of Terminations: 2; Min Operating Temperature: -55°C; Max Operating Temperature: 155°C; Length: 990.6µm; Composition: Thick Film; Case/Package: 0402; Tolerance: 1%
R13 = R01-0402-01-00337-2: RES SMD 75K OHM 1% 1/16W 0402; Manufacturer: Yageo; Temperature Coefficient: 100 ppm/ºC; Power Rating: 62.5mW; Voltage Rating: 50V; Features: Automotive AEC-Q200, Moisture Resistant; Composition: Thick Film; Width: 508µm; Length: 990.6µm; Number of Terminations: 2; Tolerance: 1%; Min Operating Temperature: -55°C; RoHS: Yes; Height: 370µm; Manufacturer P/N: AC0402FR-0775KL; Max Operating Temperature: 155°C; Packaging: Tape & Reel; Case/Package: 0402
R14 = R01-0402-01-00237-2: RES SMD 25.5K OHM 1% 1/16W 0402; Manufacturer: Yageo; Power Rating: 62.5mW; Voltage Rating: 50V; Temperature Coefficient: 100 ppm/ºC; Composition: Thick Film; Width: 508µm; Number of Terminations: 2; Case/Package: 0402; RoHS: Yes; Height: 370µm; Tolerance: 1%; Packaging: Tape & Reel; Min Operating Temperature: -55°C; Max Operating Temperature: 155°C; Length: 990.6µm; Manufacturer P/N: AC0402FR-0725K5L; Features: Automotive AEC-Q200, Moisture Resistant
R17-R23 = R01-0402-01-00437-2: as R42 on sheet Sheet1; Packaging: Tape & Reel; Manufacturer P/N: AC0402FR-07240RL; Height: 370µm; Case/Package: 0402; Composition: Thick Film; Max Operating Temperature: 155°C; Number of Terminations: 2; RoHS: Yes; Min Operating Temperature: -55°C; Tolerance: 1%; Width: 508µm; Length: 990.6µm; Features: Automotive AEC-Q200, Moisture Resistant
R24 R25 R27 R30 R31 R33 R35 R38 = R01-0402-01-00475-2: RES SMD 348K OHM 1% 1/16W 0402; Manufacturer: Yageo; Temperature Coefficient: 100 ppm/ºC; Voltage Rating: 50V; Power Rating: 62.5mW; Features: Automotive AEC-Q200, Moisture Resistant; Number of Terminations: 2; Case/Package: 0402; Packaging: Tape & Reel; Height: 370µm; Width: 508µm; RoHS: Yes; Manufacturer P/N: AC0402FR-07348KL; Composition: Thick Film; Max Operating Temperature: 155°C; Min Operating Temperature: -55°C; Tolerance: 1%; Length: 990.6µm
R26 = R01-0402-01-00404-2: RES SMD 165 OHM 1% 1/16W 0402; Manufacturer: Yageo; Power Rating: 62.5mW; Voltage Rating: 50V; Temperature Coefficient: 100 ppm/ºC; Width: 508µm; Max Operating Temperature: 155°C; Manufacturer P/N: AC0402FR-07165RL; Case/Package: 0402; Height: 370µm; Number of Terminations: 2; Tolerance: 1%; Min Operating Temperature: -55°C; RoHS: Yes; Length: 990.6µm; Features: Automotive AEC-Q200, Moisture Resistant; Packaging: Tape & Reel; Composition: Thick Film
R28 = R01-0402-01-00008-7: RES SMD 1.5K OHM 1% 1/16W 0402; Manufacturer: Yageo; Voltage Rating: 50V; Temperature Coefficient: 100 ppm/ºC; Power Rating: 62.5mW; Number of Terminations: 2; Packaging: Tape & Reel; Case/Package: 0402; Tolerance: 1%; Height: 370µm; Min Operating Temperature: -55°C; RoHS: Yes; Features: Automotive AEC-Q200, Moisture Resistant; Composition: Thick Film; Max Operating Temperature: 155°C; Width: 508µm; Length: 990.6µm; Manufacturer P/N: AC0402FR-071K5L
R29 = R01-0402-01-00492-2: RES SMD 412 OHM 1% 1/16W 0402; Manufacturer: Yageo; Temperature Coefficient: 100 ppm/ºC; Power Rating: 62.5mW; Voltage Rating: 50V; Tolerance: 1%; Features: Automotive AEC-Q200, Moisture Resistant; Length: 990.6µm; Case/Package: 0402; Composition: Thick Film; Min Operating Temperature: -55°C; RoHS: Yes; Packaging: Tape & Reel; Manufacturer P/N: AC0402FR-07412RL; Width: 508µm; Max Operating Temperature: 155°C; Number of Terminations: 2; Height: 370µm
R32 = R01-0402-01-00517-2: RES SMD 536K OHM 1% 1/16W 0402; Manufacturer: Yageo; Voltage Rating: 50V; Power Rating: 62.5mW; Temperature Coefficient: 100 ppm/ºC; Features: Automotive AEC-Q200, Moisture Resistant; Length: 990.6µm; Number of Terminations: 2; Max Operating Temperature: 155°C; RoHS: Yes; Composition: Thick Film; Case/Package: 0402; Width: 508µm; Manufacturer P/N: AC0402FR-07536KL; Packaging: Tape & Reel; Tolerance: 1%; Height: 370µm; Min Operating Temperature: -55°C
R34 = R01-0402-01-00133-2: RES SMD 6.2K OHM 1% 1/16W 0402; Manufacturer: Yageo; Power Rating: 62.5mW; Voltage Rating: 50V; Temperature Coefficient: 100 ppm/ºC; Max Operating Temperature: 155°C; Min Operating Temperature: -55°C; Packaging: Tape & Reel; Composition: Thick Film; Manufacturer P/N: AC0402FR-076K2L; Case/Package: 0402; Width: 508µm; Features: Automotive AEC-Q200, Moisture Resistant; RoHS: Yes; Tolerance: 1%; Height: 370µm; Length: 990.6µm; Number of Terminations: 2
R36 = R01-0402-01-00067-3: as R8 on sheet Sheet1; Tolerance: 1%; Length: 990.6µm; Width: 508µm; Number of Terminations: 2; Packaging: Tape & Reel; Composition: Thick Film; RoHS: Yes; Height: 370µm; Case/Package: 0402; Manufacturer P/N: AC0402FR-072KL; Features: Automotive AEC-Q200, Moisture Resistant; Min Operating Temperature: -55°C; Max Operating Temperature: 155°C
R37 = R01-0402-01-00345-2: RES SMD 82K OHM 1% 1/16W 0402; Manufacturer: Yageo; Temperature Coefficient: 100 ppm/ºC; Voltage Rating: 50V; Power Rating: 62.5mW; Width: 508µm; RoHS: Yes; Length: 990.6µm; Max Operating Temperature: 155°C; Features: Automotive AEC-Q200, Moisture Resistant; Composition: Thick Film; Packaging: Tape & Reel; Min Operating Temperature: -55°C; Number of Terminations: 2; Height: 370µm; Manufacturer P/N: AC0402FR-0782KL; Case/Package: 0402; Tolerance: 1%
R39 = R01-0402-01-00394-2: RES SMD 150 OHM 1% 1/16W 0402; Manufacturer: Yageo; Voltage Rating: 50V; Temperature Coefficient: 100 ppm/ºC; Power Rating: 62.5mW; Number of Terminations: 2; RoHS: Yes; Packaging: Tape & Reel; Features: Automotive AEC-Q200, Moisture Resistant; Width: 508µm; Manufacturer P/N: AC0402FR-07150RL; Min Operating Temperature: -55°C; Height: 370µm; Composition: Thick Film; Length: 990.6µm; Tolerance: 1%; Case/Package: 0402; Max Operating Temperature: 155°C
R40 = R01-0402-01-00027-2: RES SMD 1.91K OHM 1% 1/16W 0402; Manufacturer: Yageo; Temperature Coefficient: 100 ppm/ºC; Voltage Rating: 50V; Power Rating: 62.5mW; Features: Automotive AEC-Q200, Moisture Resistant; Width: 508µm; Manufacturer P/N: AC0402FR-071K91L; Tolerance: 1%; Packaging: Tape & Reel; RoHS: Yes; Composition: Thick Film; Min Operating Temperature: -55°C; Max Operating Temperature: 155°C; Case/Package: 0402; Height: 370µm; Length: 990.6µm; Number of Terminations: 2
R41 = R01-0603-01-00000-4: RES SMD 0 OHM 1% 1/10W 0603; Manufacturer: Yageo; Power Rating: 100mW; Temperature Coefficient: 200 ppm/ºC; Voltage Rating1: 75V; Voltage Rating: 50V; Number of Terminations: 2; Length: 1.6002µm; Composition: Thick Film; Min Operating Temperature: -55°C; Max Operating Temperature: 155°C; Width: 800µm; Height: 550µm; Case/Package: 0603; RoHS: Yes; Manufacturer P/N: AC0603FR-070RL; Tolerance: 1%; Features: Automotive AEC-Q200, Moisture Resistant; Packaging: Tape & Reel
U9 = CMP-014-00003-2: Amp INSTR Amp Single ±18V 8-Pin MSOP; Manufacturer: Analog; Channels: 1; Power: 200mW; Min Supply Voltage: 2.3V; Max Supply Voltage: 36V; Max Operating Temperature: 85°C; Mounting Technology: SMD; Output Type: -; Case/Package: MSOP; Manufacturer P/N: AD8221ARMZ-RL; Min Operating Temperature: -40°C; Pins: 8; RoHS Compliant: yes
U10 = CMP-014-00004-1: Single JFET-input improved offset operational amplifier 8-SOIC 0 to 70; Manufacturer: Texas Instrument; Power: 680mW; Max Supply Voltage: 30V; Output Type: FET; Channels: 1; Min Supply Voltage: 3.5V; Pins: 8; Max Operating Temperature: 70°C; RoHS Compliant: yes; Mounting Technology: SMD; Manufacturer P/N: TL081ACD; Case/Package: SOIC8; Min Operating Temperature: 0°C
U11 U12 = CMP-014-00002-1: Op Amp Dual GP R-R I/O 6V Automotive 8-Pin SOIC; Manufacturer: Microchip; Min Supply Voltage: 1.8V; Channels: 2; Case/Package: SOIC; Manufacturer P/N: MCP6402T-H/SN; Output Type: -; Max Supply Voltage: 6V; Mounting Technology: SMD; Max Operating Temperature: 150°C; Min Operating Temperature: -40°C; RoHS Compliant: yes; Pins: 8

## Sheet Sheet3.SchDoc
size 420 x 297 mm
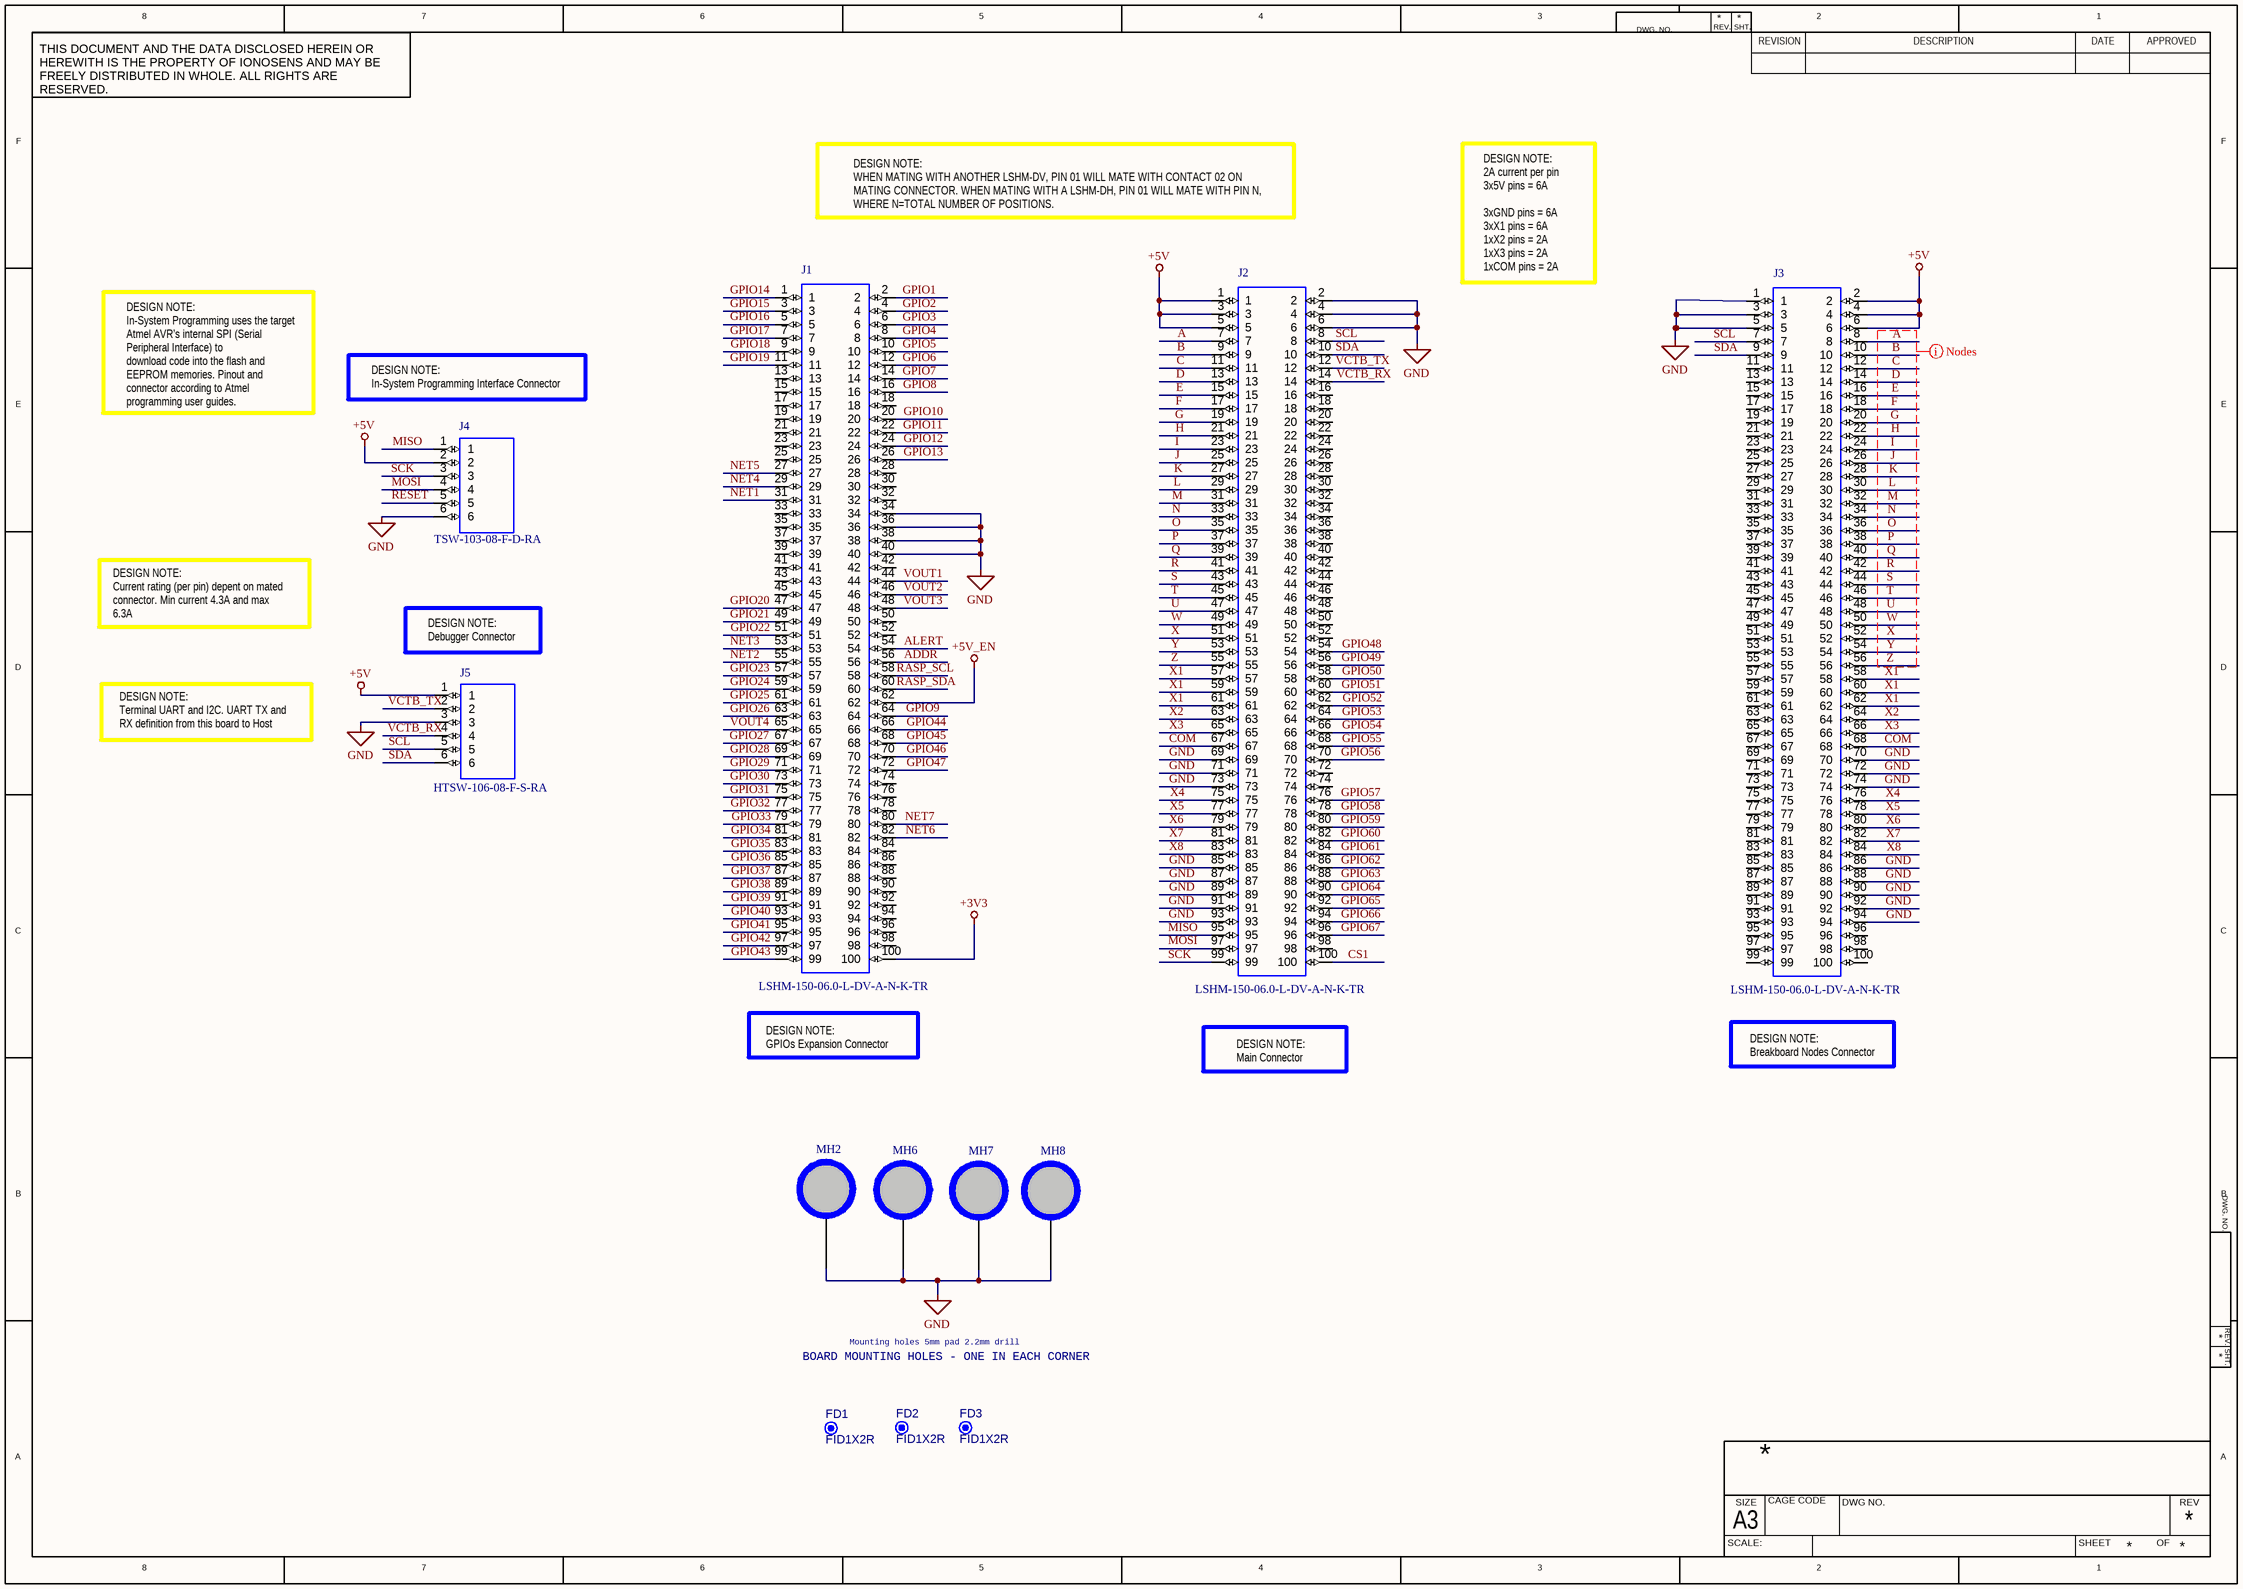
[diagram p2: Sheet3.SchDoc]

### Parts
FD1  FID1X2R  [FID1X2R]  (no BOM)
FD2  FID1X2R  [FID1X2R]  (no BOM)
FD3  FID1X2R  [FID1X2R]  (no BOM)
J1  LSHM-150-06.0-L-DV-A-N-K-TR  [LSHM_150_06_0_L_DV_A_N_K_TR]
J2  LSHM-150-06.0-L-DV-A-N-K-TR  [LSHM_150_06_0_L_DV_A_N_K_TR]
J3  LSHM-150-06.0-L-DV-A-N-K-TR  [LSHM_150_06_0_L_DV_A_N_K_TR]
J4  TSW-103-08-F-D-RA  [TSW-103-08-F-D-RA]
J5  HTSW-106-08-F-S-RA  [TSW-106-08-F-S-RA]
MH2  C500h220  [C500h220z368]  (value not drawn)
MH6  C500h220  [C500h220z368]  (value not drawn)
MH7  C500h220  [C500h220z368]  (value not drawn)
MH8  C500h220  [C500h220z368]  (value not drawn)

### Nets
+3V3: J1.100
+5V: J2.1 J2.3 J2.5 J3.2 J3.4 J3.6 J4.2 J5.1
+5V_EN: J1.62
GND: J1.34 J1.36 J1.38 J1.40 J2.2 J2.4 J2.6 J2.69 J2.71 J2.73 J2.85 J2.87 J2.89 J2.91 J2.93 J3.1 J3.3 J3.5 J3.70 J3.72 J3.74 J3.86 J3.88 J3.90 J3.92 J3.94 J4.6 J5.3 MH2.1 MH6.1 MH7.1 MH8.1
NET5: J1.27
A: J2.7 J3.8
ADDR: J1.56
ALERT: J1.54
B: J2.9 J3.10
C: J2.11 J3.12
COM: J2.67 J3.68
CS1: J2.100
D: J2.13 J3.14
E: J2.15 J3.16
F: J2.17 J3.18
G: J2.19 J3.20
GPIO1: J1.2
GPIO2: J1.4
GPIO3: J1.6
GPIO4: J1.8
GPIO5: J1.10
GPIO6: J1.12
GPIO7: J1.14
GPIO8: J1.16
GPIO9: J1.64
GPIO10: J1.20
GPIO11: J1.22
GPIO12: J1.24
GPIO13: J1.26
GPIO14: J1.1
GPIO15: J1.3
GPIO16: J1.5
GPIO17: J1.7
GPIO18: J1.9
GPIO19: J1.11
GPIO20: J1.47
GPIO21: J1.49
GPIO22: J1.51
GPIO23: J1.57
GPIO24: J1.59
GPIO25: J1.61
GPIO26: J1.63
GPIO27: J1.67
GPIO28: J1.69
GPIO29: J1.71
GPIO30: J1.73
GPIO31: J1.75
GPIO32: J1.77
GPIO33: J1.79
GPIO34: J1.81
GPIO35: J1.83
GPIO36: J1.85
GPIO37: J1.87
GPIO38: J1.89
GPIO39: J1.91
GPIO40: J1.93
GPIO41: J1.95
GPIO42: J1.97
GPIO43: J1.99
GPIO44: J1.66
GPIO45: J1.68
GPIO46: J1.70
GPIO47: J1.72
GPIO48: J2.54
GPIO49: J2.56
GPIO50: J2.58
GPIO51: J2.60
GPIO52: J2.62
GPIO53: J2.64
GPIO54: J2.66
GPIO55: J2.68
GPIO56: J2.70
GPIO57: J2.76
GPIO58: J2.78
GPIO59: J2.80
GPIO60: J2.82
GPIO61: J2.84
GPIO62: J2.86
GPIO63: J2.88
GPIO64: J2.90
GPIO65: J2.92
GPIO66: J2.94
GPIO67: J2.96
H: J2.21 J3.22
I: J2.23 J3.24
J: J2.25 J3.26
K: J2.27 J3.28
L: J2.29 J3.30
M: J2.31 J3.32
MISO: J2.95 J4.1
MOSI: J2.97 J4.4
N: J2.33 J3.34
NET1: J1.31
NET2: J1.55
NET3: J1.53
NET4: J1.29
NET6: J1.82
NET7: J1.80
O: J2.35 J3.36
P: J2.37 J3.38
Q: J2.39 J3.40
R: J2.41 J3.42
RASP_SCL: J1.58
RASP_SDA: J1.60
RESET: J4.5
S: J2.43 J3.44
SCK: J2.99 J4.3
SCL: J2.8 J3.7 J5.5
SDA: J2.10 J3.9 J5.6
T: J2.45 J3.46
U: J2.47 J3.48
VCTB_RX: J2.14 J5.4
VCTB_TX: J2.12 J5.2
VOUT1: J1.44
VOUT2: J1.46
VOUT3: J1.48
VOUT4: J1.65
W: J2.49 J3.50
X: J2.51 J3.52
X1: J2.57 J2.59 J2.61 J3.58 J3.60 J3.62
X2: J2.63 J3.64
X3: J2.65 J3.66
X4: J2.75 J3.76
X5: J2.77 J3.78
X6: J2.79 J3.80
X7: J2.81 J3.82
X8: J2.83 J3.84
Y: J2.53 J3.54
Z: J2.55 J3.56

Not connected (* = marked no-connect by the designer): J1 13 15 17 18 19 21 23 25 28 30 32 33 35 37 39 41 42 43 45 50 52 74 76 78 84 86 88 90 92 94 96 98; J2 16 18 20 22 24 26 28 30 32 34 36 38 40 42 44 46 48 50 52 72 74 98; J3 11 13 15 17 19 21 23 25 27 29 31 33 35 37 39 41 43 45 47 49 51 53 55 57 59 61 63 65 67 69 71 73 75 77 79 81 83 85 87 89 91 93 95 96 97 98 99 100

### Layout directives
net class Nodes: A, B, C, D, E, F, G, H, I, J, K, L, M, N, O, P, Q, R, S, T, U, W, X, Y, Z

### Notes on the sheet
- DESIGN NOTE:
  WHEN MATING WITH ANOTHER LSHM-DV, PIN 01 WILL MATE WITH CONTACT 02 ON
  MATING CONNECTOR. WHEN MATING WITH A LSHM-DH, PIN 01 WILL MATE WITH PIN N,
  WHERE N=TOTAL NUMBER OF POSITIONS.
- DESIGN NOTE:
  2A current per pin
  3x5V pins = 6A
  3xGND pins = 6A
  3xX1 pins = 6A
  1xX2 pins = 2A
  1xX3 pins = 2A
  1xCOM pins = 2A
- DESIGN NOTE:
  In-System Programming Interface Connector
- DESIGN NOTE:
  In-System Programming uses the target Atmel AVR’s internal SPI (Serial Peripheral Interface) to
  download code into the flash and EEPROM memories. Pinout and connector according to Atmel programming user guides.
- DESIGN NOTE:
  Current rating (per pin) depent on mated connector. Min current 4.3A and max 6.3A
- (near J5) DESIGN NOTE:
  Debugger Connector
- DESIGN NOTE:
  Terminal UART and I2C. UART TX and RX definition from this board to Host
- DESIGN NOTE:
  GPIOs Expansion Connector
- DESIGN NOTE:
  Main Connector
- DESIGN NOTE:
  Breakboard Nodes Connector
- BOARD MOUNTING HOLES - ONE IN EACH CORNER
- Mounting holes 5mm pad 2.2mm drill
- 8
- 7
- 6
- 5
- 4
- 3
- DWG. NO.
- REV.
- SHT.
- REVISION
- 2
- DESCRIPTION
- DATE
- 1
- APPROVED
- THIS DOCUMENT AND THE DATA DISCLOSED HEREIN OR HEREWITH IS THE PROPERTY OF IONOSENS AND MAY BE FREELY DISTRIBUTED IN WHOLE. ALL RIGHTS ARE RESERVED.
- F
- E
- D
- C
- B
- A
- SCALE:
- A3
- SIZE
- CAGE CODE
- DWG NO.
- SHEET
- OF
- REV

### Library data of the parts
FD1-FD3 = CMP-00028-00005-2: Fiducial - Round 1x2mm; Pins: 0
J1-J3 = J01-001-01-00001-2: Conn Socket and Terminal Strip HDR/SKT 100 POS 0.5mm Solder ST SMD T/R; Manufacturer: Samtec; Gender: HERMAPHRODITIC; Pitch: 500 µm; Contact Plating: Gold; Case/Package: SMD; Max Operating Temperature: 125°C; Number of Rows: 2; RoHS Compliant: Yes; Housing Color: Black; Mounting Technology: SMD; Pins: 100; Termination: Solder; Orientation: Straight; Depth: 4.98 mm; Length: 29.7 mm; Contact Material: Bronze; Housing Material: Polymer; Min Operating Temperature: -55°C; Manufacturer P/N: LSHM-150-06.0-L-DV-A-N-K-TR
J4 = J01-001-01-00003-2: 6 Vias Pin Header 2.54mm, Right Angle; Manufacturer: Samtec; Gender: Male; RoHS Compliant: Yes; Min Operating Temperature: -55°C; Case/Package: Through Hole; Termination: Solder; Depth: 4.87 mm; Max Operating Temperature: 125°C; Housing Material: Polyester; Mounting Technology: Through Hole; Number of Rows: 2; Pitch: 2.54mm; Contact Plating: Gold; Contact Material: Bronze; Manufacturer P/N: TSW-103-08-F-D-RA; Pins: 6; Orientation: Straight; Length: 7.62 mm; Housing Color: Black
J5 = J01-001-01-00005-2: 6 Vias Pin Header 2.54mm, Right Angle, 1 Row; Manufacturer: Samtec; Gender: Male; Manufacturer P/N: HTSW-106-08-F-S-RA; Contact Plating: Gold; Length: 7.62 mm; Pins: 6; Housing Material: Polyester; Housing Color: Black; RoHS Compliant: Yes; Case/Package: Through Hole; Pitch: 2.54mm; Mounting Technology: Through Hole; Depth: 4.87 mm; Orientation: Straight; Number of Rows: 2; Contact Material: Bronze; Max Operating Temperature: 125°C; Min Operating Temperature: -55°C; Termination: Solder
MH2 MH6-MH8 = CMP-00028-00007-2: hole 5mm pad drill 2.2; Manufacturer: Ionosens; Manufacturer P/N: H5D22; Mounting Technology: Pad; RoHS Compliant: yes; Case/Package: Pad; Min Operating Temperature: 125°C; Pins: 1; Max Operating Temperature: -40°C

## Nets that join several sheets
3V3_REF: Sheet1 (R6.2 U5.7 U5.8), Sheet2 (R34.2)
1024V_REF: Sheet1 (R7.2 U6.7 U6.8), Sheet2 (U9.6 U11.5)
+3V3: Sheet1 (5 pins), Sheet2 (K7.4), Sheet3 (J1.100)
+5V: Sheet1 (27 pins), Sheet2 (19 pins), Sheet3 (8 pins)
+5V_EN: Sheet2 (K5.4), Sheet3 (J1.62)
GND: Sheet1 (42 pins), Sheet2 (15 pins), Sheet3 (32 pins)
NET5: Sheet2 (R34.1 R40.2 U12.3), Sheet3 (J1.27)
ADDR: Sheet1 (R2.1 U2.1), Sheet3 (J1.56)
ALERT: Sheet1 (R1.1 U2.2), Sheet3 (J1.54)
C: Sheet2 (K3.4), Sheet3 (J2.11 J3.12)
COIL1: Sheet1 (U1.10), Sheet2 (D1.1 K1.3)
COIL2: Sheet1 (U1.12), Sheet2 (D3.1 K2.3)
COIL3: Sheet1 (U1.15), Sheet2 (D2.1 K3.3)
COIL4: Sheet1 (U1.16), Sheet2 (D4.1 K4.3)
COIL5: Sheet1 (U1.13), Sheet2 (D6.1 K5.3)
COIL6: Sheet1 (U1.14), Sheet2 (D5.1 K6.3)
COIL7: Sheet1 (U1.11), Sheet2 (D7.1 K7.3)
CS1: Sheet1 (U3.19), Sheet3 (J2.100)
D: Sheet2 (K6.4), Sheet3 (J2.13 J3.14)
F: Sheet2 (K4.1), Sheet3 (J2.17 J3.18)
GPIO1: Sheet1 (U3.23), Sheet3 (J1.2)
GPIO2: Sheet1 (U3.25), Sheet3 (J1.4)
GPIO3: Sheet1 (U3.26), Sheet3 (J1.6)
GPIO4: Sheet1 (U3.24), Sheet3 (J1.8)
GPIO5: Sheet1 (U3.27), Sheet3 (J1.10)
GPIO6: Sheet1 (U3.28), Sheet3 (J1.12)
GPIO7: Sheet1 (U3.18), Sheet3 (J1.14)
GPIO8: Sheet1 (U3.17), Sheet3 (J1.16)
GPIO9: Sheet1 (U3.66), Sheet3 (J1.64)
GPIO10: Sheet1 (U3.13), Sheet3 (J1.20)
GPIO11: Sheet1 (U3.12), Sheet3 (J1.22)
GPIO12: Sheet1 (U3.9), Sheet3 (J1.24)
GPIO13: Sheet1 (U3.8), Sheet3 (J1.26)
GPIO14: Sheet1 (U3.7), Sheet3 (J1.1)
GPIO15: Sheet1 (U3.6), Sheet3 (J1.3)
GPIO16: Sheet1 (U3.5), Sheet3 (J1.5)
GPIO17: Sheet1 (U3.4), Sheet3 (J1.7)
GPIO18: Sheet1 (U3.97), Sheet3 (J1.9)
GPIO19: Sheet1 (U3.96), Sheet3 (J1.11)
GPIO20: Sheet1 (U3.72), Sheet3 (J1.47)
GPIO21: Sheet1 (U3.71), Sheet3 (J1.49)
GPIO22: Sheet1 (U3.70), Sheet3 (J1.51)
GPIO23: Sheet1 (U3.69), Sheet3 (J1.57)
GPIO24: Sheet1 (U3.68), Sheet3 (J1.59)
GPIO25: Sheet1 (U3.67), Sheet3 (J1.61)
GPIO26: Sheet1 (U3.76), Sheet3 (J1.63)
GPIO27: Sheet1 (U3.77), Sheet3 (J1.67)
GPIO28: Sheet1 (U3.78), Sheet3 (J1.69)
GPIO29: Sheet1 (U3.79), Sheet3 (J1.71)
GPIO30: Sheet1 (U3.82), Sheet3 (J1.73)
GPIO31: Sheet1 (U3.83), Sheet3 (J1.75)
GPIO32: Sheet1 (U3.84), Sheet3 (J1.77)
GPIO33: Sheet1 (U3.85), Sheet3 (J1.79)
GPIO34: Sheet1 (U3.86), Sheet3 (J1.81)
GPIO35: Sheet1 (U3.87), Sheet3 (J1.83)
GPIO36: Sheet1 (U3.88), Sheet3 (J1.85)
GPIO37: Sheet1 (U3.89), Sheet3 (J1.87)
GPIO38: Sheet1 (U3.90), Sheet3 (J1.89)
GPIO39: Sheet1 (U3.91), Sheet3 (J1.91)
GPIO40: Sheet1 (U3.92), Sheet3 (J1.93)
GPIO41: Sheet1 (U3.93), Sheet3 (J1.95)
GPIO42: Sheet1 (U3.94), Sheet3 (J1.97)
GPIO43: Sheet1 (U3.95), Sheet3 (J1.99)
GPIO44: Sheet1 (U3.65), Sheet3 (J1.66)
GPIO45: Sheet1 (U3.64), Sheet3 (J1.68)
GPIO46: Sheet1 (U3.63), Sheet3 (J1.70)
GPIO47: Sheet1 (U3.60), Sheet3 (J1.72)
GPIO48: Sheet1 (U3.59), Sheet3 (J2.54)
GPIO49: Sheet1 (U3.58), Sheet3 (J2.56)
GPIO50: Sheet1 (U3.57), Sheet3 (J2.58)
GPIO51: Sheet1 (U3.56), Sheet3 (J2.60)
GPIO52: Sheet1 (U3.55), Sheet3 (J2.62)
GPIO53: Sheet1 (U3.54), Sheet3 (J2.64)
GPIO54: Sheet1 (U3.53), Sheet3 (J2.66)
GPIO55: Sheet1 (U3.52), Sheet3 (J2.68)
GPIO56: Sheet1 (U3.51), Sheet3 (J2.70)
GPIO57: Sheet1 (U3.45), Sheet3 (J2.76)
GPIO58: Sheet1 (U3.46), Sheet3 (J2.78)
GPIO59: Sheet1 (U3.47), Sheet3 (J2.80)
GPIO60: Sheet1 (U3.48), Sheet3 (J2.82)
GPIO61: Sheet1 (U3.49), Sheet3 (J2.84)
GPIO62: Sheet1 (U3.50), Sheet3 (J2.86)
GPIO63: Sheet1 (U3.15), Sheet3 (J2.88)
GPIO64: Sheet1 (U3.14), Sheet3 (J2.90)
GPIO65: Sheet1 (U3.1), Sheet3 (J2.92)
GPIO66: Sheet1 (U3.29), Sheet3 (J2.94)
GPIO67: Sheet1 (U3.42), Sheet3 (J2.96)
MISO: Sheet1 (U3.22 U4.9 U7.9), Sheet3 (J2.95 J4.1)
MOSI: Sheet1 (U3.21 U4.3 U7.3), Sheet3 (J2.97 J4.4)
NET1: Sheet2 (R32.1 R37.2 U12.5), Sheet3 (J1.31)
NET2: Sheet2 (Q1.2 R36.2 U11.6), Sheet3 (J1.55)
NET3: Sheet2 (Q1.1 R28.1 R30.1), Sheet3 (J1.53)
NET4: Sheet2 (R39.1 R41.2), Sheet3 (J1.29)
NET6: Sheet2 (R12.1 R13.2 U9.4), Sheet3 (J1.82)
NET7: Sheet2 (R15.1 R16.2 U9.1), Sheet3 (J1.80)
P0W: Sheet1 (U4.7), Sheet2 (R28.2)
P1W: Sheet1 (U7.6), Sheet2 (R40.1)
P2W: Sheet1 (U7.8), Sheet2 (R13.1)
RASP_SCL: Sheet1 (R3.1 U2.10 U8.7), Sheet2 (K3.1), Sheet3 (J1.58)
RASP_SDA: Sheet1 (R4.1 U2.9 U8.6), Sheet2 (K6.1), Sheet3 (J1.60)
RESET: Sheet1 (R5.1 U3.30), Sheet3 (J4.5)
SCK: Sheet1 (U3.20 U4.2 U7.2), Sheet3 (J2.99 J4.3)
SCL: Sheet1 (U3.43), Sheet3 (J2.8 J3.7 J5.5)
SDA: Sheet1 (U3.44), Sheet3 (J2.10 J3.9 J5.6)
VCTB_RX: Sheet1 (U3.2), Sheet3 (J2.14 J5.4)
VCTB_TX: Sheet1 (U3.3), Sheet3 (J2.12 J5.2)
VOUT1: Sheet1 (R11.1), Sheet2 (U12.6 U12.7), Sheet3 (J1.44)
VOUT2: Sheet1 (R10.2), Sheet2 (R25.2 U11.1), Sheet3 (J1.46)
VOUT3: Sheet1 (R9.2), Sheet2 (R24.2 U10.6), Sheet3 (J1.48)
VOUT4: Sheet1 (R8.2), Sheet2 (U9.7), Sheet3 (J1.65)
X1: Sheet2 (K1.1), Sheet3 (6 pins)
X2: Sheet2 (K2.1), Sheet3 (J2.63 J3.64)
X4: Sheet2 (K7.1), Sheet3 (J2.75 J3.76)
X5: Sheet2 (K5.1), Sheet3 (J2.77 J3.78)

## Assembly variants
VCTB E: not fitted R41